# Altium project MainBoard Pro Mini.PrjPcb
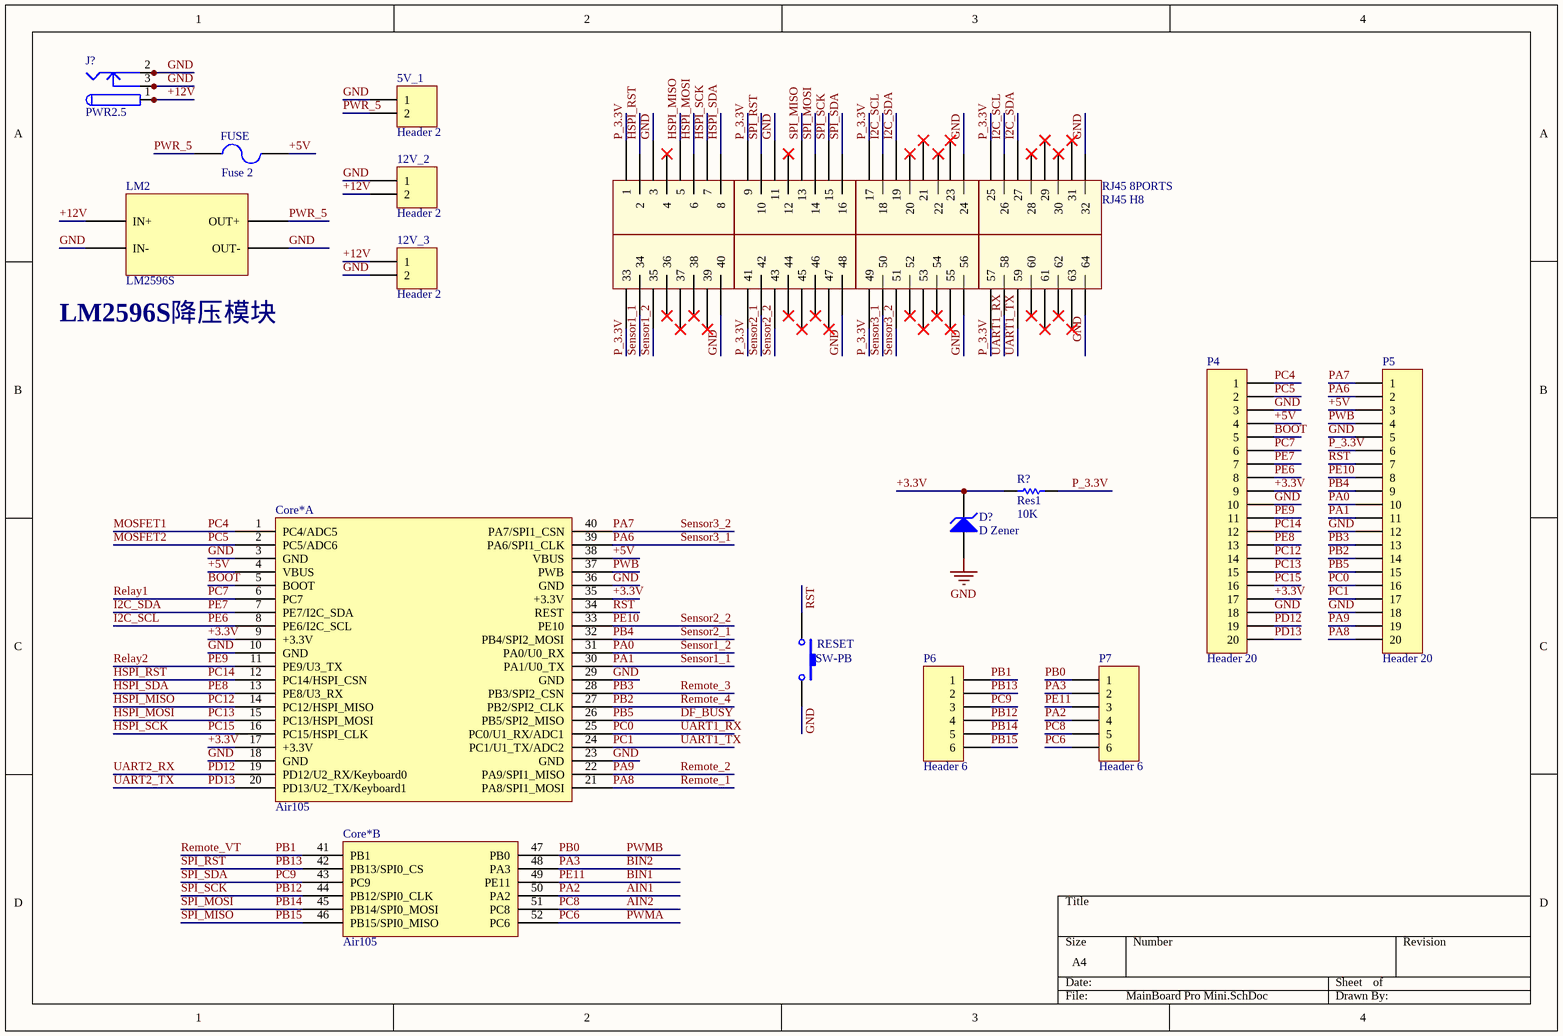
[diagram p0: MainBoard Pro Mini.SchDoc]
2 sheets, 39 parts. Net scope: global (net labels, ports and power ports of the same name join across sheets).
Board file: MainBoard Pro Mini.PcbDoc
Sheets:
  MainBoard Pro Mini.SchDoc
  MainBoard Pro Mini_2.SchDoc

## Sheet MainBoard Pro Mini.SchDoc
size A4; SheetNumber: 1; SheetTotal: 2

### Parts
5V_1  Header 2  [KF2EDGK5.0-LI-2P]
12V_2  Header 2  [KF2EDGK5.0-LI-2P]
12V_3  Header 2  [KF2EDGK5.0-WI-2P]
Core*  Air105  [Luat_Air105]  (parts A,B of 2)
D?  D Zener  [LLDS  // LS-34]
FUSE  Fuse 2  [FU 5x20]
J?  PWR2.5  [PJ-017D]
LM2  LM2596S  [MP1584EN]
P4  Header 20  [HDR1X20]
P5  Header 20  [HDR1X20]
P6  Header 6  [HDR1X6]
P7  Header 6  [HDR1X6]
R?  Res1  value 10K  [0603/1608 R0]
RESET  SW-PB  [PB_ALPS_SKHHLQA010]
RJ45_8PORTS  RJ45 H8  [RJ45_8ports]

### Nets
GND: 5V_1.1 12V_2.1 12V_3.2 Core*.3(GND) Core*.10(GND) Core*.18(GND) Core*.23(GND) Core*.29(GND) Core*.36(GND) D?.1(A) J?.2 J?.2A J?.2B J?.3 J?.3A J?.3B LM2.1(IN-) LM2.3(OUT-) P4.3 P4.10 P4.18 P5.5 P5.12 P5.18 RESET.2 RJ45_8PORTS.3 RJ45_8PORTS.11 RJ45_8PORTS.24 RJ45_8PORTS.32 RJ45_8PORTS.40 RJ45_8PORTS.48 RJ45_8PORTS.56 RJ45_8PORTS.64
+3.3V: Core*.9(+3.3V) Core*.17(+3.3V) Core*.35(+3.3V) D?.2(K) P4.9 P4.17 R?.1
+5V: Core*.4(VBUS) Core*.38(VBUS) FUSE.2 P4.4 P5.3
+12V: 12V_2.2 12V_3.1 J?.1 J?.1A J?.1B LM2.2(IN+)
AIN1: Core*.50(PA2) P7.4  [also labelled PA2]
AIN2: Core*.51(PC8) P7.5  [also labelled PC8]
BIN1: Core*.49(PE11) P7.3  [also labelled PE11]
BIN2: Core*.48(PA3) P7.2  [also labelled PA3]
BOOT: Core*.5(BOOT) P4.5
DF_BUSY: Core*.26(PB5/SPI2_MISO) P5.15  [also labelled PB5]
HSPI_MISO: Core*.14(PC12/HSPI_MISO) P4.14 RJ45_8PORTS.5  [also labelled PC12]
HSPI_MOSI: Core*.15(PC13/HSPI_MOSI) P4.15 RJ45_8PORTS.6  [also labelled PC13]
HSPI_RST: Core*.12(PC14/HSPI_CSN) P4.12 RJ45_8PORTS.2  [also labelled PC14]
HSPI_SCK: Core*.16(PC15/HSPI_CLK) P4.16 RJ45_8PORTS.7  [also labelled PC15]
HSPI_SDA: Core*.13(PE8/U3_RX) P4.13 RJ45_8PORTS.8  [also labelled PE8]
I2C_SCL: Core*.8(PE6/I2C_SCL) P4.8 RJ45_8PORTS.18 RJ45_8PORTS.26  [also labelled PE6]
I2C_SDA: Core*.7(PE7/I2C_SDA) P4.7 RJ45_8PORTS.19 RJ45_8PORTS.27  [also labelled PE7]
MOSFET1: Core*.1(PC4/ADC5) P4.1  [also labelled PC4]
MOSFET2: Core*.2(PC5/ADC6) P4.2  [also labelled PC5]
P_3.3V: P5.6 R?.2 RJ45_8PORTS.1 RJ45_8PORTS.9 RJ45_8PORTS.17 RJ45_8PORTS.25 RJ45_8PORTS.33 RJ45_8PORTS.41 RJ45_8PORTS.49 RJ45_8PORTS.57
PA0: Core*.31(PA0/U0_RX) P5.10 RJ45_8PORTS.35  [also labelled Sensor1_2]
PA1: Core*.30(PA1/U0_TX) P5.11 RJ45_8PORTS.34  [also labelled Sensor1_1]
PA6: Core*.39(PA6/SPI1_CLK) P5.2 RJ45_8PORTS.50  [also labelled Sensor3_1]
PA7: Core*.40(PA7/SPI1_CSN) P5.1 RJ45_8PORTS.51  [also labelled Sensor3_2]
PA8: Core*.21(PA8/SPI1_MOSI) P5.20  [also labelled Remote_1]
PA9: Core*.22(PA9/SPI1_MISO) P5.19  [also labelled Remote_2]
PB0: Core*.47(PB0) P7.1  [also labelled PWMB]
PB1: Core*.41(PB1) P6.1  [also labelled Remote_VT]
PB2: Core*.27(PB2/SPI2_CLK) P5.14  [also labelled Remote_4]
PB3: Core*.28(PB3/SPI2_CSN) P5.13  [also labelled Remote_3]
PB4: Core*.32(PB4/SPI2_MOSI) P5.9 RJ45_8PORTS.42  [also labelled Sensor2_1]
PB12: Core*.44(PB12/SPI0_CLK) P6.4 RJ45_8PORTS.15  [also labelled SPI_SCK]
PB13: Core*.42(PB13/SPI0_CS) P6.2 RJ45_8PORTS.10  [also labelled SPI_RST]
PB14: Core*.45(PB14/SPI0_MOSI) P6.5 RJ45_8PORTS.14  [also labelled SPI_MOSI]
PB15: Core*.46(PB15/SPI0_MISO) P6.6 RJ45_8PORTS.13  [also labelled SPI_MISO]
PC0: Core*.25(PC0/U1_RX/ADC1) P5.16 RJ45_8PORTS.58  [also labelled UART1_RX]
PC1: Core*.24(PC1/U1_TX/ADC2) P5.17 RJ45_8PORTS.59  [also labelled UART1_TX]
PC6: Core*.52(PC6) P7.6  [also labelled PWMA]
PC7: Core*.6(PC7) P4.6  [also labelled Relay1]
PC9: Core*.43(PC9) P6.3 RJ45_8PORTS.16  [also labelled SPI_SDA]
PD12: Core*.19(PD12/U2_RX/Keyboard0) P4.19  [also labelled UART2_RX]
PD13: Core*.20(PD13/U2_TX/Keyboard1) P4.20  [also labelled UART2_TX]
PE9: Core*.11(PE9/U3_TX) P4.11  [also labelled Relay2]
PE10: Core*.33(PE10) P5.8 RJ45_8PORTS.43  [also labelled Sensor2_2]
PWB: Core*.37(PWB) P5.4
PWR_5: 5V_1.2 FUSE.1 LM2.4(OUT+)
RST: Core*.34(REST) P5.7 RESET.1

Not connected (* = marked no-connect by the designer): RJ45_8PORTS 4* 12* 20* 21* 22* 23* 28* 29* 30* 31* 36* 37* 38* 39* 44* 45* 46* 47* 52* 53* 54* 55* 60* 61* 62* 63*

### Notes on the sheet
- (near LM2) LM2596S降压模块

### Library data of the parts
5V_1 12V_2 12V_3 = Header 2: Header, 2-Pin; LatestRevisionDate: 17-Jul-2002; LatestRevisionNote: Re-released for DXP Platform.; Publisher: Altium Limited
D? = D Zener: Zener Diode; Published: 8-Jun-2000; LatestRevisionDate: 17-Jul-2002; LatestRevisionNote: Re-released for DXP Platform.; PackageReference: DIODE-0.7; Publisher: Altium Limited
FUSE = Fuse 2: Fuse; Published: 8-Jun-2000; LatestRevisionDate: 17-Jul-2002; LatestRevisionNote: Re-released for DXP Platform.; PackageReference: PIN-W2/E2.8; Publisher: Altium Limited; PackageDescription: Thru-Hole; 2 Leads
J? = PWR2.5: Low Voltage Power Supply Connector; Published: 17-Dec-2003; DatasheetDocument: 09-May-2002; Publisher: Altium Limited; ComponentLink1Description: Manufacturer Link; ComponentLink1URL: http://domino.kycon.com/internet/Products.html
LM2 = LM2596S: 降压模块
P4 P5 = Header 20: Header, 20-Pin; LatestRevisionDate: 17-Jul-2002; LatestRevisionNote: Re-released for DXP Platform.; Publisher: Altium Limited
P6 P7 = Header 6: Header, 6-Pin; LatestRevisionDate: 17-Jul-2002; LatestRevisionNote: Re-released for DXP Platform.; Publisher: Altium Limited
R? = Res1: Resistor; Published: 8-Jun-2000; LatestRevisionDate: 17-Jul-2002; LatestRevisionNote: Re-released for DXP Platform.; PackageReference: AXIAL-0.3; Publisher: Altium Limited; PackageDescription: Axial Device, Thru-Hole; 2 Leads; 0.3 in Pin Spacing
RESET = SW-PB: 微动开关; Published: 24-Mar-1999; LatestRevisionDate: 17-Jul-2002; LatestRevisionNote: Re-released for DXP Platform.; PackageReference: SPST-2; Publisher: Altium Limited

## Sheet MainBoard Pro Mini_2.SchDoc
size A4; SheetNumber: 2; SheetTotal: 2
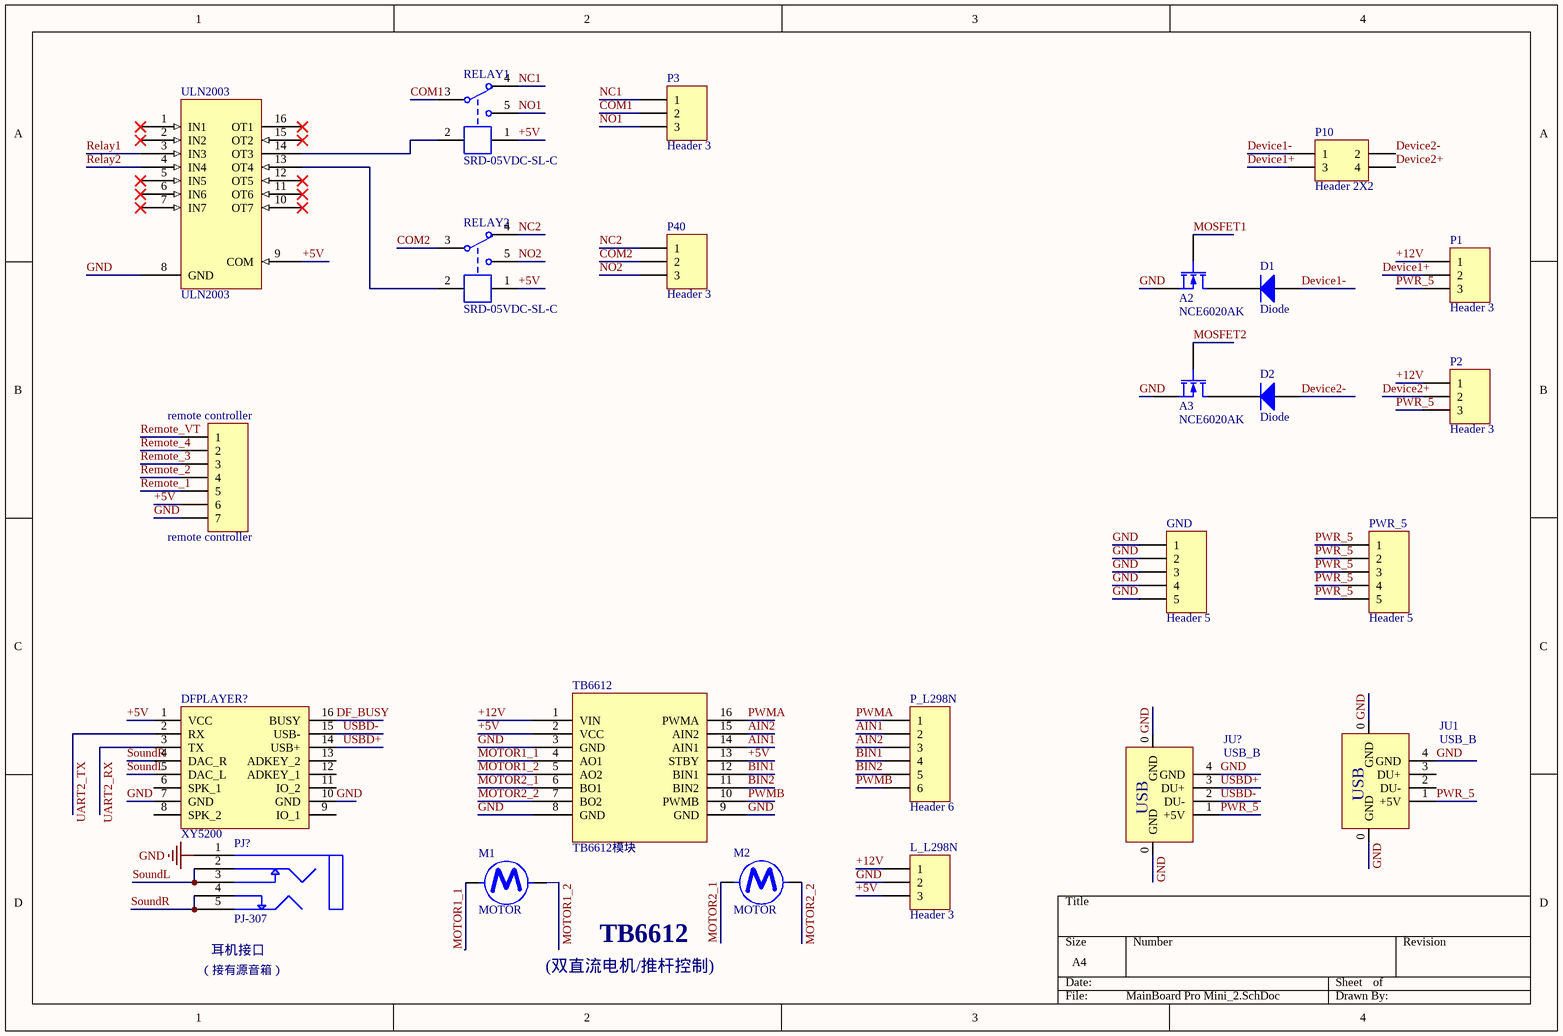
[diagram p1: MainBoard Pro Mini_2.SchDoc]

### Parts
A2  NCE6020AK  [TO252-2L]
A3  NCE6020AK  [TO252-2L]
D1  Diode  [DO-214AC]
D2  Diode  [DO-214AC]
DFPLAYER?  XY5200  [DFPlayer]
GND  Header 5  [HDR1X5]
JU1  USB_B  [USB-48204-0001]
JU?  USB_B  [USB-1734085]
L_L298N  Header 3  [PHOENIX_1715734]
M1  MOTOR  [KF2EDGK5.0-WI-2P]
M2  MOTOR  [KF2EDGK5.0-WI-2P]
P1  Header 3  [COMATEL_385.0358.1.03.400]
P2  Header 3  [COMATEL_385.0358.1.03.400]
P3  Header 3  [PHOENIX_1715734]
P10  Header 2X2  [CK-5.08-2x2]
P40  Header 3  [PHOENIX_1715734]
P_L298N  Header 6  [2-644861-6 _2.54]
PJ?  PJ-307  [PJ-307X]
PWR_5  Header 5  [HDR1X5]
RELAY1  SRD-05VDC-SL-C  [REL_FINDER_36.11]
RELAY2  SRD-05VDC-SL-C  [REL_FINDER_36.11]
remote_controller  remote controller  [HDR2.54-M-LI-7P]
TB6612  TB6612模块  [TB6612]
ULN2003  ULN2003  [SO-16 - 1.27]

### Nets
GND: A2.3(S) A3.3(S) DFPLAYER?.7(GND) DFPLAYER?.10(GND) GND.1 GND.2 GND.3 GND.4 GND.5 JU1.0(GND) JU1.4(GND) JU?.0(GND) JU?.4(GND) L_L298N.2 PJ?.1(L) remote_controller.7 TB6612.3(GND) TB6612.8(GND) TB6612.9(GND) ULN2003.8(GND)
+5V: DFPLAYER?.1(VCC) L_L298N.3 RELAY1.1 RELAY2.1 remote_controller.6 TB6612.2(VCC) TB6612.13(STBY) ULN2003.9(COM)
+12V: L_L298N.1 P1.1 P2.1 TB6612.1(VIN)
AIN1: P_L298N.2 TB6612.14(AIN1)
AIN2: P_L298N.3 TB6612.15(AIN2)
BIN1: P_L298N.4 TB6612.12(BIN1)
BIN2: P_L298N.5 TB6612.11(BIN2)
COM1: P3.2 RELAY1.3
COM2: P40.2 RELAY2.3
Device1+: P1.2 P10.3
Device1-: D1.1(A) P10.1
Device2+: P2.2 P10.4
Device2-: D2.1(A) P10.2
DF_BUSY: DFPLAYER?.16(BUSY)
MOSFET1: A2.2(G)
MOSFET2: A3.2(G)
MOTOR1_1: M1.1(A) TB6612.4(AO1)
MOTOR1_2: M1.2(B) TB6612.5(AO2)
MOTOR2_1: M2.1(A) TB6612.6(BO1)
MOTOR2_2: M2.2(B) TB6612.7(BO2)
NC1: P3.1 RELAY1.4
NC2: P40.1 RELAY2.4
NO1: P3.3 RELAY1.5
NO2: P40.3 RELAY2.5
PWMA: P_L298N.1 TB6612.16(PWMA)  [project net PC6]
PWMB: P_L298N.6 TB6612.10(PWMB)  [project net PB0]
PWR_5: JU1.1(+5V) JU?.1(+5V) P1.3 P2.3 PWR_5.1 PWR_5.2 PWR_5.3 PWR_5.4 PWR_5.5
Relay1: ULN2003.3(IN3)  [project net PC7]
Relay2: ULN2003.4(IN4)  [project net PE9]
Remote_1: remote_controller.5  [project net PA8]
Remote_2: remote_controller.4  [project net PA9]
Remote_3: remote_controller.3  [project net PB3]
Remote_4: remote_controller.2  [project net PB2]
Remote_VT: remote_controller.1  [project net PB1]
SoundL: DFPLAYER?.5(DAC_L) PJ?.2(L1) PJ?.3(R1)
SoundR: DFPLAYER?.4(DAC_R) PJ?.4(R) PJ?.5(COM)
UART2_RX: DFPLAYER?.3(TX)  [project net PD12]
UART2_TX: DFPLAYER?.2(RX)  [project net PD13]
USBD+: DFPLAYER?.14(USB+) JU?.3(DU+)
USBD-: DFPLAYER?.15(USB-) JU?.2(DU-)
NetA2_1: A2.1(D) D1.2(K)
NetA3_1: A3.1(D) D2.2(K)
NetRELAY1_2: RELAY1.2 ULN2003.14(OT3)
NetRELAY2_2: RELAY2.2 ULN2003.13(OT4)

Not connected (* = marked no-connect by the designer): DFPLAYER? 6(SPK_1) 8(SPK_2) 9(IO_1) 11(IO_2) 12(ADKEY_1) 13(ADKEY_2); JU1 2(DU-) 3(DU+); ULN2003 1(IN1)* 2(IN2)* 5(IN5)* 6(IN6)* 7(IN7)* 10(OT7)* 11(OT6)* 12(OT5)* 15(OT2)* 16(OT1)*

### Notes on the sheet
- （接有源音箱）
- (near PJ?) 耳机接口
- (双直流电机/推杆控制)
- TB6612
- (in symbol USB_B) USB

### Library data of the parts
A2 A3 = MOSFET-N: N-Channel MOSFET; Published: 8-Jun-2000; LatestRevisionDate: 17-Jul-2002; LatestRevisionNote: Re-released for DXP Platform.; PackageVersion: 1995/1996; PackageReference: E3; Publisher: Altium Limited; PackageDescription: TO, Flat Index; 3 In-Line, Axial Leads; Body Dia. 4.6mm; Lead Dia. 0.5 mm (max)
D1 D2 = Diode: Default Diode; Published: 8-Jun-2000; LatestRevisionDate: 17-Jul-2002; LatestRevisionNote: Re-released for DXP Platform.; PackageVersion: Sep-1996; PackageReference: SMC; Publisher: Altium Limited; PackageDescription: DO-214-AB/SMC; 2 C-Bend Leads; Body 7.9 x 5.9 mm, inc. leads (LxW); Code_JEDEC: DO-214-AB
DFPLAYER? = Mini MP3 Player: MP3模块; 版权归属: 封装库来自淘宝 ID：黄晶宝石; BOM名称: MP3模块; 学习资源: https://shop463601444.taobao.com
GND PWR_5 = Header 5: Header, 5-Pin; LatestRevisionDate: 17-Jul-2002; LatestRevisionNote: Re-released for DXP Platform.; Publisher: Altium Limited
L_L298N P1-P3 P40 = Header 3: Header, 3-Pin; LatestRevisionDate: 17-Jul-2002; LatestRevisionNote: Re-released for DXP Platform.; Publisher: Altium Limited
P10 = Header 2X2: Header, 2-Pin, Dual row; LatestRevisionDate: 17-Jul-2002; LatestRevisionNote: Re-released for DXP Platform.; Publisher: Altium Limited
P_L298N = Header 6: Header, 6-Pin; LatestRevisionDate: 17-Jul-2002; LatestRevisionNote: Re-released for DXP Platform.; Publisher: Altium Limited
PJ? = PJ-307: 立体声耳机插座
RELAY1 RELAY2 = SRD-05VDC-SL-C: 5V一组转换; BOM名称: 5V继电器; 版权归属: 封装库来自淘宝卖家 ID：黄晶宝石; 学习资源: https://shop463601444.taobao.com
remote_controller = Header 7: Header, 7-Pin; LatestRevisionDate: 17-Jul-2002; LatestRevisionNote: Re-released for DXP Platform.; Publisher: Altium Limited
TB6612 = TB6612
ULN2003 = ULN2003: 达林顿驱动芯片

## Nets that join several sheets
GND: MainBoard Pro Mini (33 pins), MainBoard Pro Mini_2 (20 pins)
+5V: MainBoard Pro Mini (5 pins), MainBoard Pro Mini_2 (8 pins)
+12V: MainBoard Pro Mini (6 pins), MainBoard Pro Mini_2 (L_L298N.1 P1.1 P2.1 TB6612.1)
AIN1: MainBoard Pro Mini (Core*.50 P7.4), MainBoard Pro Mini_2 (P_L298N.2 TB6612.14)
AIN2: MainBoard Pro Mini (Core*.51 P7.5), MainBoard Pro Mini_2 (P_L298N.3 TB6612.15)
BIN1: MainBoard Pro Mini (Core*.49 P7.3), MainBoard Pro Mini_2 (P_L298N.4 TB6612.12)
BIN2: MainBoard Pro Mini (Core*.48 P7.2), MainBoard Pro Mini_2 (P_L298N.5 TB6612.11)
DF_BUSY: MainBoard Pro Mini (Core*.26 P5.15), MainBoard Pro Mini_2 (DFPLAYER?.16)
MOSFET1: MainBoard Pro Mini (Core*.1 P4.1), MainBoard Pro Mini_2 (A2.2)
MOSFET2: MainBoard Pro Mini (Core*.2 P4.2), MainBoard Pro Mini_2 (A3.2)
PA8: MainBoard Pro Mini (Core*.21 P5.20), MainBoard Pro Mini_2 (remote_controller.5)
PA9: MainBoard Pro Mini (Core*.22 P5.19), MainBoard Pro Mini_2 (remote_controller.4)
PB0: MainBoard Pro Mini (Core*.47 P7.1), MainBoard Pro Mini_2 (P_L298N.6 TB6612.10)
PB1: MainBoard Pro Mini (Core*.41 P6.1), MainBoard Pro Mini_2 (remote_controller.1)
PB2: MainBoard Pro Mini (Core*.27 P5.14), MainBoard Pro Mini_2 (remote_controller.2)
PB3: MainBoard Pro Mini (Core*.28 P5.13), MainBoard Pro Mini_2 (remote_controller.3)
PC6: MainBoard Pro Mini (Core*.52 P7.6), MainBoard Pro Mini_2 (P_L298N.1 TB6612.16)
PC7: MainBoard Pro Mini (Core*.6 P4.6), MainBoard Pro Mini_2 (ULN2003.3)
PD12: MainBoard Pro Mini (Core*.19 P4.19), MainBoard Pro Mini_2 (DFPLAYER?.3)
PD13: MainBoard Pro Mini (Core*.20 P4.20), MainBoard Pro Mini_2 (DFPLAYER?.2)
PE9: MainBoard Pro Mini (Core*.11 P4.11), MainBoard Pro Mini_2 (ULN2003.4)
PWR_5: MainBoard Pro Mini (5V_1.2 FUSE.1 LM2.4), MainBoard Pro Mini_2 (9 pins)